# Altium schematic sheet 座头鲸.SchDoc
size A3
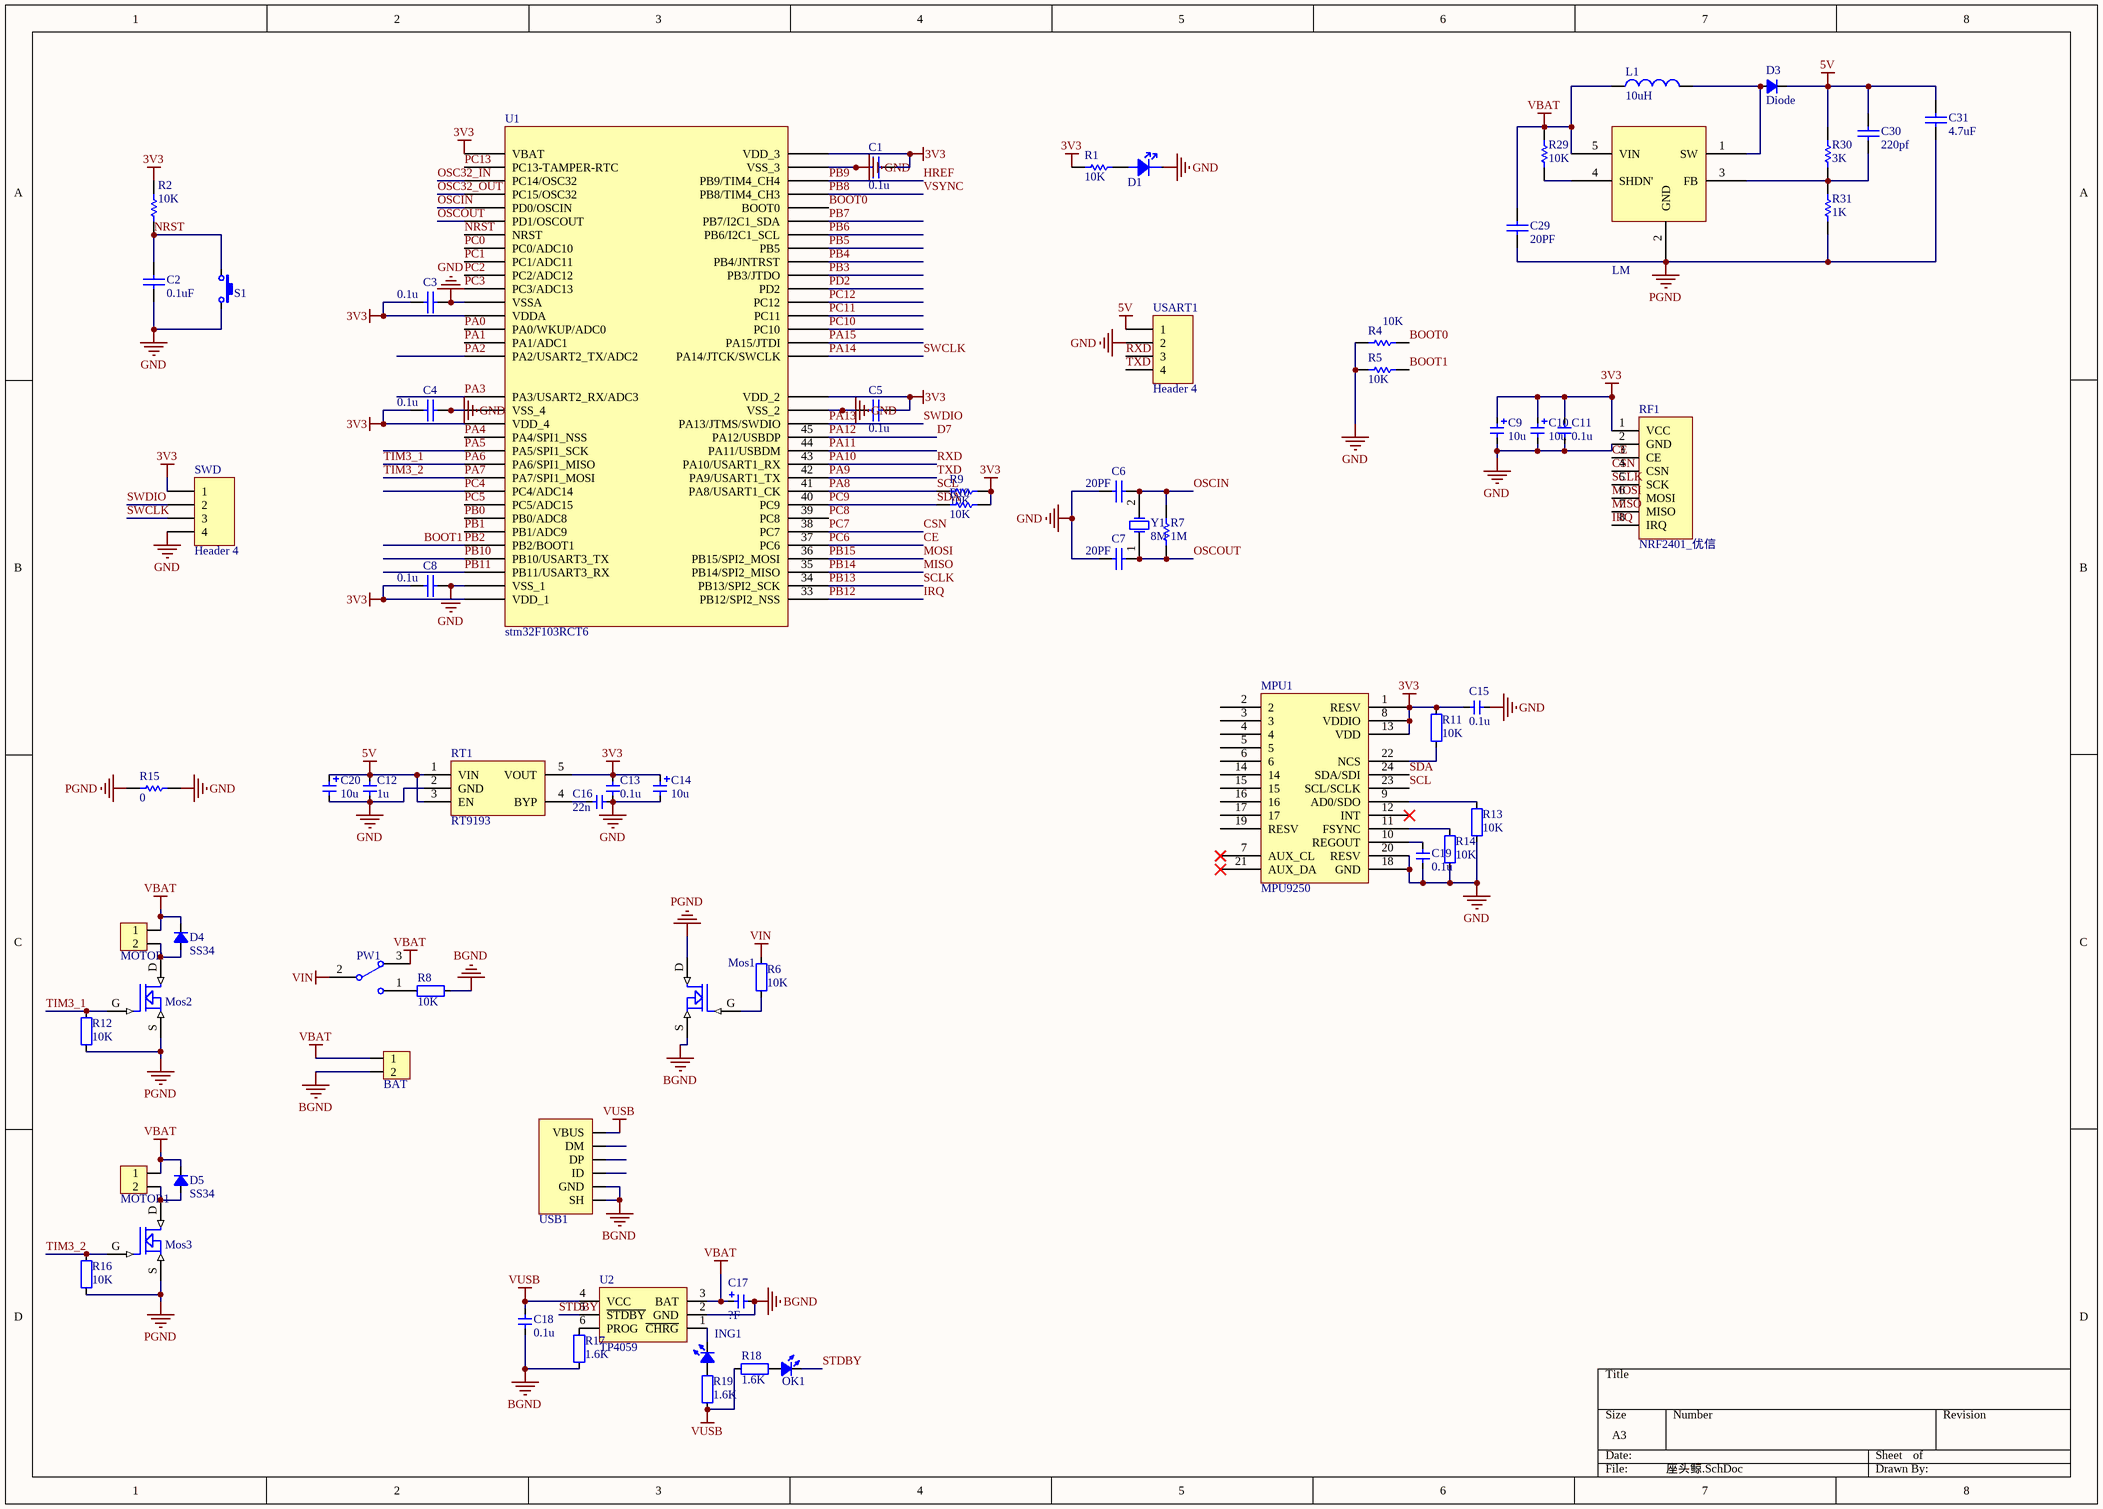
[diagram p0: 座头鲸.SchDoc]

## Parts
?  LM  [LM27313]
BAT  HDR1x2_2.54  [HDR1X2_2.54_90]  (value not drawn)
C1  value 0.1u  [CAP_0603]  (hidden comment: Cap)
C2  value 0.1uF  [CAP_0603]  (hidden comment: Cap)
C3  value 0.1u  [CAP_0603]  (hidden comment: Cap)
C4  value 0.1u  [CAP_0603]  (hidden comment: Cap)
C5  value 0.1u  [CAP_0603]  (hidden comment: Cap)
C6  value 20PF  [CAP_0603]  (hidden comment: Cap)
C7  value 20PF  [CAP_0603]  (hidden comment: Cap)
C8  value 0.1u  [CAP_0603]  (hidden comment: Cap)
C9  value 10u  [CAP_TAN_P0805]  (hidden comment: Cap_Tan_0805)
C10  value 10u  [CAP_TAN_P0805]  (hidden comment: Cap_Tan_0805)
C11  value 0.1u  [CAP_0603]  (hidden comment: Cap_0603)
C12  value 1u  [CAP_0603]  (hidden comment: Cap_0603)
C13  value 0.1u  [CAP_0603]  (hidden comment: Cap_0603)
C14  value 10u  [CAP_TAN_P0805]  (hidden comment: Cap_Tan_0805)
C15  value 0.1u  [CAP_0603]  (hidden comment: Cap_0603)
C16  value 22n  [CAP_0603]  (hidden comment: Cap_0603)
C17  value ?F  [CAP_TAN_D2917]  (hidden comment: Cap_Tan_2917)
C18  value 0.1u  [CAP_0603]  (hidden comment: Cap_0603)
C19  value 0.1u  [CAP_0603]  (hidden comment: Cap_0603)
C20  value 10u  [CAP_TAN_P0805]  (hidden comment: Cap_Tan_0805)
C29  value 20PF  [CAP_0603]  (hidden comment: Cap)
C30  value 220pf  [CAP_0603]  (hidden comment: Cap)
C31  value 4.7uF  [CAP_0603]  (hidden comment: Cap)
D1  lED  [0805D]  (value not drawn)
D3  Diode  [LED_0805_RED]
D4  value SS34  [DO-214AC]  (hidden comment: Diode_SMA)
D5  value SS34  [DO-214AC]  (hidden comment: Diode_SMA)
ING1  LED_0805  [LED_0805_RED]  (value not drawn)
L1  value 10uH  [IND_CD32]  (hidden comment: Inductor)
Mos1  MOSFET N  [Nmos_SOT23]  (value not drawn)
Mos2  MOSFET N  [Nmos_SOT23]  (value not drawn)
Mos3  MOSFET N  [Nmos_SOT23]  (value not drawn)
MOTOR  HDR1x2_2.54  [HDR1X2_2.54_180]  (value not drawn)
MOTOR1  HDR1x2_2.54  [HDR1X2_2.54_180]  (value not drawn)
MPU1  MPU9250  [QFN_P0.4_24]
OK1  LED_0805  [LED_0805_GREEN]  (value not drawn)
PW1  SwitchSPDT_2.8x6.6_90  [SwitchSPDT_2.8X6.6_90]  (value not drawn)
R1  value 10K  [RES_0603]  (hidden comment: Res1)
R2  value 10K  [RES_0603]  (hidden comment: Res1)
R4  value 10K  [RES_0603]  (hidden comment: Res1)
R5  value 10K  [RES_0603]  (hidden comment: Res1)
R6  value 10K  [RES_0603]  (hidden comment: Res_0603)
R7  value 1M  [RES_0603]  (hidden comment: Res1)
R8  value 10K  [RES_0603]  (hidden comment: Res_0603)
R9  value 10K  [RES_0603]  (hidden comment: Res1)
R10  value 10K  [RES_0603]  (hidden comment: Res1)
R11  value 10K  [RES_0603]  (hidden comment: Res_0603)
R12  value 10K  [RES_0603]  (hidden comment: Res_0603)
R13  value 10K  [RES_0603]  (hidden comment: Res_0603)
R14  value 10K  [RES_0603]  (hidden comment: Res_0603)
R15  value 0  [RES-0603]  (hidden comment: Res1)
R16  value 10K  [RES_0603]  (hidden comment: Res_0603)
R17  value 1.6K  [RES_0603]  (hidden comment: Res_0603)
R18  value 1.6K  [RES_0603]  (hidden comment: Res_0603)
R19  value 1.6K  [RES_0603]  (hidden comment: Res_0603)
R29  value 10K  [RES_0603]  (hidden comment: Res1)
R30  value 3K  [RES_0603]  (hidden comment: Res1)
R31  value 1K  [RES_0603]  (hidden comment: Res1)
RF1  NRF2401_优信  [nrf24l01_youxin]
RT1  RT9193  [SOT23-5]
S1  ButtonTACT_3x4x2_180  [ButtonTACT_3x4x2_180H]  (value not drawn)
SWD  Header 4  [HDR1X4]
U1  stm32F103RCT6  [STM32F103RCT6]
U2  TP4059  [SOT23-6]
USART1  Header 4  [HDR1X4]
USB1  USB_Micro  [USB_Micro-AB]  (value not drawn)
Y1  8M  [Osc-6032]

## Nets
3V3: C1.1 C3.1 C4.1 C5.1 C8.1 C9.1 C10.1 C11.2 C13.2 C14.1 C15.2 MPU1.1(RESV) MPU1.8(VDDIO) MPU1.13(VDD) R1.2 R2.2 R9.2 R10.2 R11.1 RF1.1(VCC) RT1.5(VOUT) SWD.1 U1.1(VBAT) U1.13(VDDA) U1.19(VDD_4) U1.32(VDD_1) U1.48(VDD_2) U1.64(VDD_3)
5V: C12.2 C20.1 C30.2 C31.2 D3.2(K) R30.1 RT1.1(VIN) RT1.3(EN) USART1.1
BGND: BAT.2 C17.2 C18.1 Mos1.S R8.2 R17.2 U2.2(GND) USB1.0(SH) USB1.5(GND)
GND: C1.2 C2.2 C3.2 C4.2 C5.2 C6.1 C7.1 C8.2 C9.2 C10.2 C11.1 C12.1 C13.1 C14.2 C15.1 C16.1 C19.2 C20.2 D1.K MPU1.18(GND) MPU1.20(RESV) R4.2 R5.2 R13.2 R14.2 R15.2 RF1.2(GND) RT1.2(GND) S1.2 SWD.4 U1.12(VSSA) U1.18(VSS_4) U1.31(VSS_1) U1.47(VSS_2) U1.63(VSS_3) USART1.2
PGND: ?.2(GND) C29.1 C31.1 Mos1.D Mos2.S Mos3.S R12.1 R15.1 R16.1 R31.2
VBAT: ?.5(VIN) BAT.1 C17.1 C29.2 D4.2(K) D5.2(K) L1.1 MOTOR.1 MOTOR1.1 PW1.3 R29.1 U2.3(BAT)
VIN: PW1.2 R6.2
VUSB: C18.2 R18.1 R19.2 U2.4(VCC) USB1.1(VBUS)
BOOT0: R4.1 U1.60(BOOT0)
BOOT1: R5.1 U1.28(PB2/BOOT1)  [also labelled PB2]
CE: RF1.3(CE) U1.37(PC6)  [also labelled PC6]
CSN: RF1.4(CSN) U1.38(PC7)  [also labelled PC7]
D7: U1.45(PA12/USBDP)  [also labelled PA12]
HREF: U1.62(PB9/TIM4_CH4)  [also labelled PB9]
IRQ: RF1.8(IRQ) U1.33(PB12/SPI2_NSS)  [also labelled PB12]
MISO: RF1.7(MISO) U1.35(PB14/SPI2_MISO)  [also labelled PB14]
MOSI: RF1.6(MOSI) U1.36(PB15/SPI2_MOSI)  [also labelled PB15]
NRST: C2.1 R2.1 S1.1 U1.7(NRST)
OSC32_IN: U1.3(PC14/OSC32)
OSC32_OUT: U1.4(PC15/OSC32)
OSCIN: C6.2 R7.2 U1.5(PD0/OSCIN) Y1.2(OSC2)
OSCOUT: C7.2 R7.1 U1.6(PD1/OSCOUT) Y1.1(OSC1)
PA0: U1.14(PA0/WKUP/ADC0)
PA1: U1.15(PA1/ADC1)
PA2: U1.16(PA2/USART2_TX/ADC2)
PA3: U1.17(PA3/USART2_RX/ADC3)
PA4: U1.20(PA4/SPI1_NSS)
PA5: U1.21(PA5/SPI1_SCK)
PA6: Mos2.G R12.2 U1.22(PA6/SPI1_MISO)  [also labelled TIM3_1]
PA7: Mos3.G R16.2 U1.23(PA7/SPI1_MOSI)  [also labelled TIM3_2]
PA8: MPU1.23(SCL/SCLK) R9.1 U1.41(PA8/USART1_CK)  [also labelled SCL]
PA9: U1.42(PA9/USART1_TX) USART1.4  [also labelled TXD]
PA10: U1.43(PA10/USART1_RX) USART1.3  [also labelled RXD]
PA11: U1.44(PA11/USBDM)
PA13: SWD.2 U1.46(PA13/JTMS/SWDIO)  [also labelled SWDIO]
PA14: SWD.3 U1.49(PA14/JTCK/SWCLK)  [also labelled SWCLK]
PA15: U1.50(PA15/JTDI)
PB0: U1.26(PB0/ADC8)
PB1: U1.27(PB1/ADC9)
PB3: U1.55(PB3/JTDO)
PB4: U1.56(PB4/JNTRST)
PB5: U1.57(PB5)
PB6: U1.58(PB6/I2C1_SCL)
PB7: U1.59(PB7/I2C1_SDA)
PB8: U1.61(PB8/TIM4_CH3)  [also labelled VSYNC]
PB10: U1.29(PB10/USART3_TX)
PB11: U1.30(PB11/USART3_RX)
PB13: RF1.5(SCK) U1.34(PB13/SPI2_SCK)  [also labelled SCLK]
PC0: U1.8(PC0/ADC10)
PC1: U1.9(PC1/ADC11)
PC2: U1.10(PC2/ADC12)
PC3: U1.11(PC3/ADC13)
PC4: U1.24(PC4/ADC14)
PC5: U1.25(PC5/ADC15)
PC8: U1.39(PC8)
PC9: MPU1.24(SDA/SDI) R10.1 U1.40(PC9)  [also labelled SDA]
PC10: U1.51(PC10)
PC11: U1.52(PC11)
PC12: U1.53(PC12)
PC13: U1.2(PC13-TAMPER-RTC)
PD2: U1.54(PD2)
STDBY: OK1.2(K) U2.5(~{STDBY})
Net?_1: ?.1(SW) D3.1(A) L1.2
Net?_3: ?.3(FB) C30.1 R30.2 R31.1
Net?_4: ?.4(SHDN') R29.2
NetC16_2: C16.2 RT1.4(BYP)
NetC19_1: C19.1 MPU1.10(REGOUT)
NetD1_A: D1.A R1.1
NetD4_1: D4.1(A) Mos2.D MOTOR.2
NetD5_1: D5.1(A) Mos3.D MOTOR1.2
NetING1_1: ING1.1(A) R19.1
NetING1_2: ING1.2(K) U2.1(~{CHRG})
NetMos1_G: Mos1.G R6.1
NetMPU1_9: MPU1.9(AD0/SDO) R13.1
NetMPU1_11: MPU1.11(FSYNC) R14.1
NetMPU1_22: MPU1.22(NCS) R11.2
NetOK1_1: OK1.1(A) R18.2
NetPW1_1: PW1.1 R8.1
NetR17_1: R17.1 U2.6(PROG)

Not connected (* = marked no-connect by the designer): MPU1 2 3 4 5 6 7(AUX_CL)* 12(INT)* 14 15 16 17 19(RESV) 21(AUX_DA)*; USB1 2(DM) 3(DP) 4(ID)

## Library data of the parts
? = LM27313
BAT = HDR1x2_2.54: Header
C1 C3-C8 C29-C31 = Cap_1: Capacitor; Published: 8-Jun-2000; LatestRevisionDate: 17-Jul-2002; LatestRevisionNote: Re-released for DXP Platform.; PackageReference: RAD-0.3; Publisher: Altium Limited
C2 = Cap: Capacitor; Published: 8-Jun-2000; LatestRevisionDate: 17-Jul-2002; LatestRevisionNote: Re-released for DXP Platform.; PackageReference: RAD-0.3; Publisher: Altium Limited
C9 C10 C14 C20 = Cap_Tan_0805: Capacitor
C11-C13 C15 C16 C18 C19 = Cap_0603: Capacitor
C17 = Cap_Tan_2917: Capacitor
D1 = 00-D-LED
D4 D5 = Diode_SMA: Diode
ING1 OK1 = LED_0805: LED
L1 = Inductor: Code_IEC: 1005; Published: 8-Jun-2000; LatestRevisionDate: 17-Jul-2002; LatestRevisionNote: Re-released for DXP Platform.; PackageReference: 0402-A; Publisher: Altium Limited; Code_JEITA: 0402
Mos1-Mos3 = MOSFET N: MOS SOT23
MOTOR MOTOR1 = HDR1x2_2.54T: Header
PW1 = SwitchSPDT_2.8x6.6_90: Switch
R1 R2 R4 R5 R7 R29-R31 = Res1_1: Resistor; Published: 8-Jun-2000; LatestRevisionDate: 17-Jul-2002; LatestRevisionNote: Re-released for DXP Platform.; PackageReference: AXIAL-0.3; Publisher: Altium Limited
R6 R8 R11-R14 R16-R19 = Res_0603: Resistor
R9 R10 R15 = Res1: Resistor; Published: 8-Jun-2000; LatestRevisionDate: 17-Jul-2002; LatestRevisionNote: Re-released for DXP Platform.; PackageReference: AXIAL-0.3; Publisher: Altium Limited
RT1 = RT9193: Power
S1 = ButtonTACT_3x4x2_180: Button
SWD USART1 = Header 4: Header, 4-Pin; LatestRevisionDate: 17-Jul-2002; LatestRevisionNote: Re-released for DXP Platform.; Publisher: Altium Limited
USB1 = USB_Micro: USB
Y1 = C-Osc: Crystal Oscillator; Published: 8-Jun-2000; LatestRevisionDate: 17-Jul-2002; LatestRevisionNote: Re-released for DXP Platform.; PackageReference: R38; Publisher: Altium Limited; PackageDescription: Crystal, Thru-Hole; 2 Leads; Body 3.1 x 8.2 mm (Dia.xH)